# EAGLE design 00A-054 (EAGLE 9.6.2)
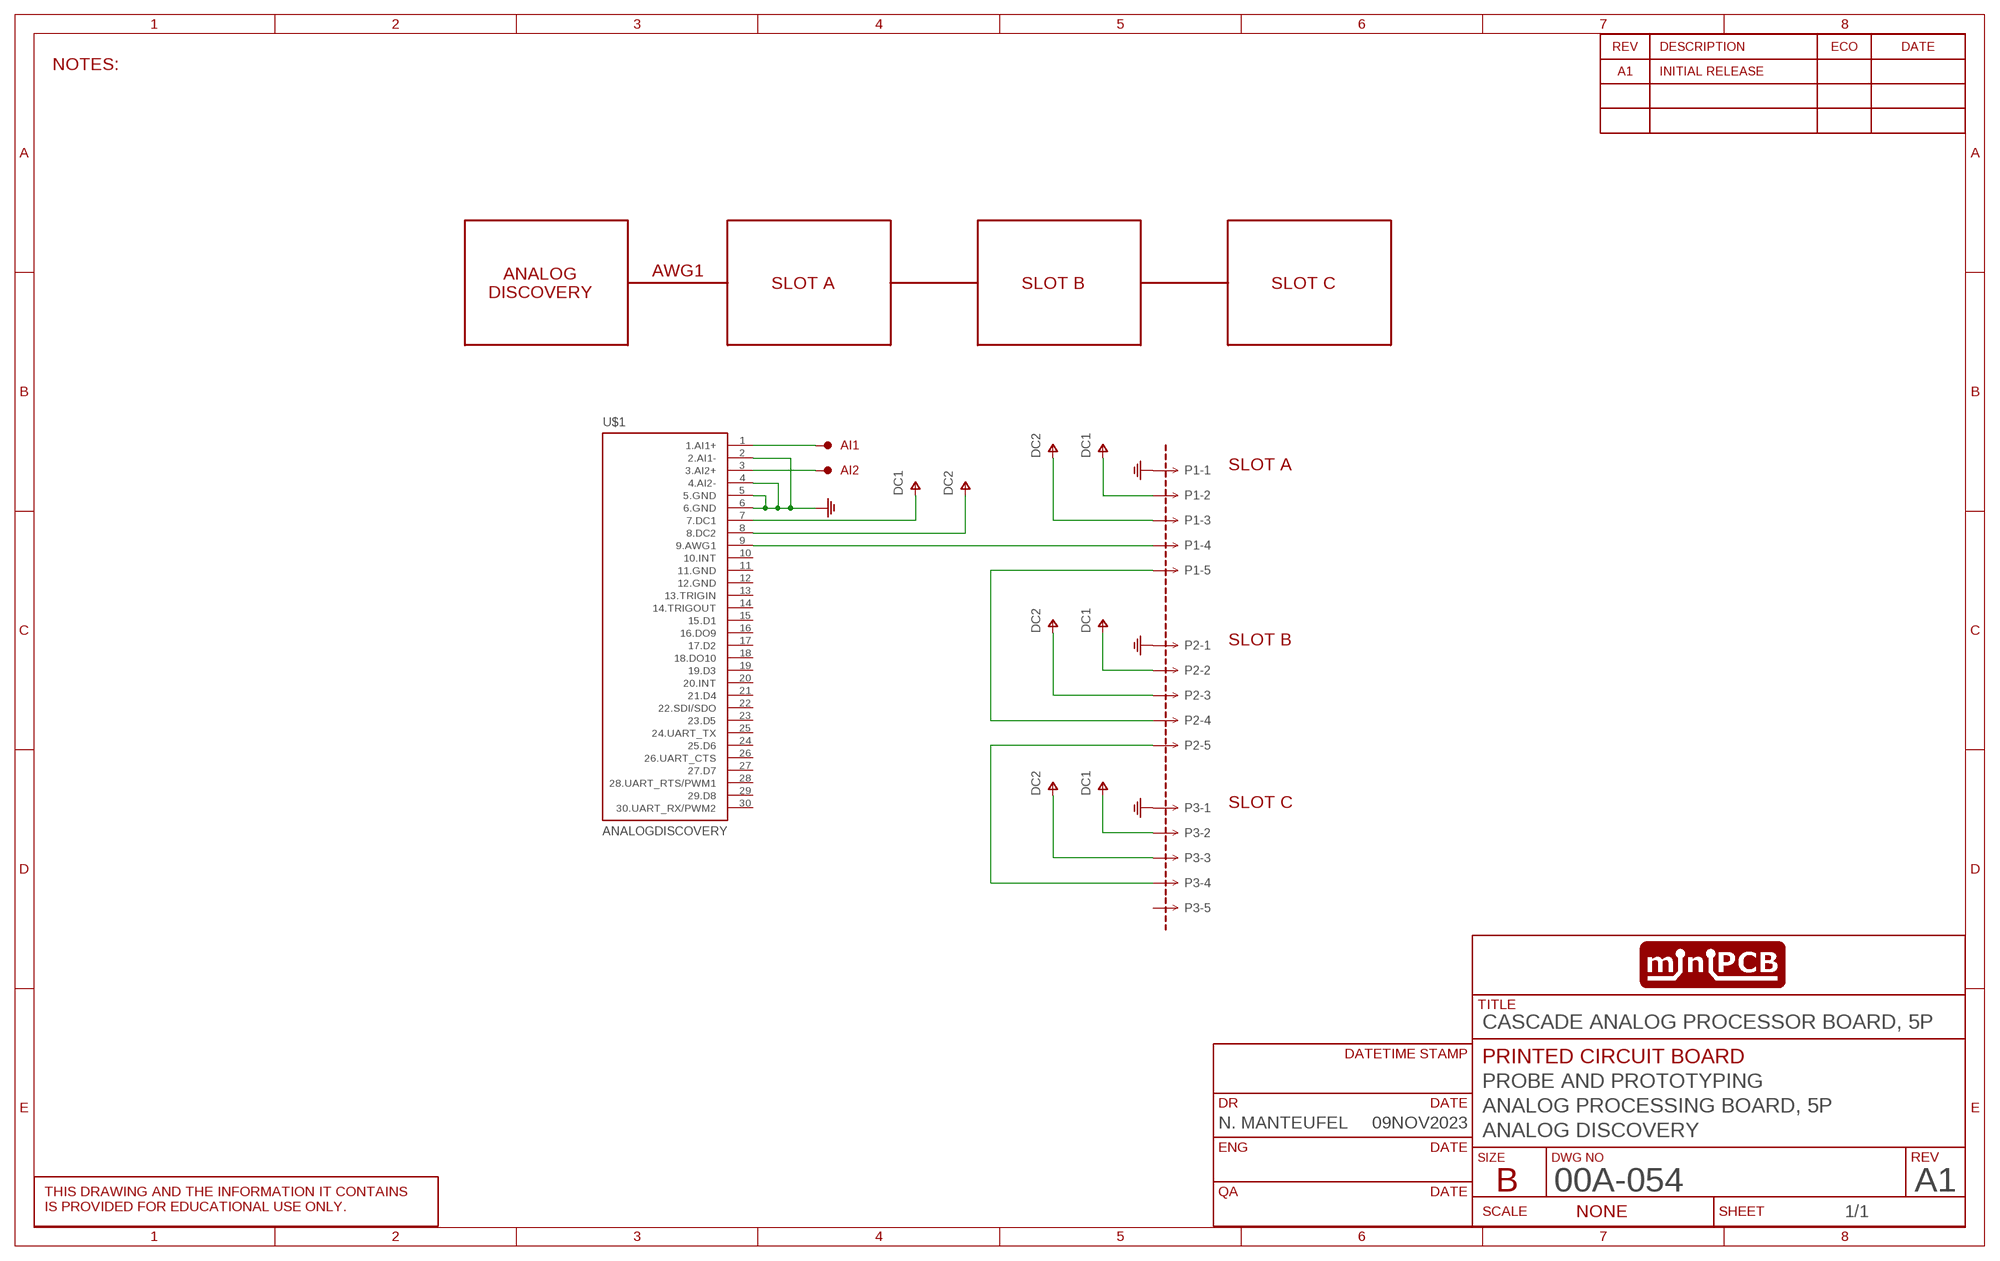
[diagram p0: schematic, sheet 1]
SHEET1 (SCHEMATIC): CIRCUIT_CATEGORY: PROBE AND PROTOTYPING; CIRCUIT_NAME: ANALOG PROCESSING BOARD, 5P; CIRCUIT_VARIANT: ANALOG DISCOVERY; DR: N. MANTEUFEL; DR_DATE: 09NOV2023; PCB_PCBA: PRINTED CIRCUIT BOARD; REVA: A1; REVISION: A1; TITLE: CASCADE ANALOG PROCESSOR BOARD, 5P

## Parts
AI1  TESTPOINTKE5000-SMTEXT  [PINS_1_TESTPOINT_KE5000_NOTEXT]
AI2  TESTPOINTKE5000-SMTEXT  [PINS_1_TESTPOINT_KE5000_NOTEXT]
P1  MINIPCB_5P5P  [PINS_1X5]
P2  MINIPCB_5P5P  [PINS_1X5]
P3  MINIPCB_5P5P  [PINS_1X5]
PCB1  MINIPCB_0P33X75  [MINIPCB_0P_33X75]
U$1  ANALOGDISCOVERY  [PINS30-2X15]

## Nets
GND: P1.1 P2.1 P3.1 U$1.2(2.AI1-) U$1.4(4.AI2-) U$1.5(5.GND) U$1.6(6.GND)
N$1: AI1.1 U$1.1(1.AI1+)
N$2: AI2.1 U$1.3(3.AI2+)
N$3: P1.4 U$1.9(9.AWG1)
N$4: P1.5 P2.4
N$5: P2.5 P3.4
V+: P1.2 P1.3 P2.2 P2.3 P3.2 P3.3 U$1.7(7.DC1) U$1.8(8.DC2) ; supply symbol labelled DC1, DC2
Unconnected: P3.5 U$1.10(10.INT) U$1.11(11.GND) U$1.12(12.GND) U$1.13(13.TRIGIN) U$1.14(14.TRIGOUT) U$1.15(15.D1) U$1.16(16.DO9) U$1.17(17.D2) U$1.18(18.DO10) U$1.19(19.D3) U$1.20(20.INT) U$1.21(21.D4) U$1.22(22.SDI/SDO) U$1.23(23.D5) U$1.24(25.D6) U$1.25(24.UART_TX) U$1.26(26.UART_CTS) U$1.27(27.D7) U$1.28(28.UART_RTS/PWM1) U$1.29(29.D8) U$1.30(30.UART_RX/PWM2)

## Notes on the sheet
- NOTES:
- AWG1
- ANALOG
  DISCOVERY
- SLOT A | SLOT B | SLOT C
- SLOT A
- SLOT B
- SLOT C

## Library data of the parts
AI1 AI2 = minipcb:TESTPOINT
P1-P3 = minipcb:MINIPCB_5P
PCB1 = minipcb:MINIPCB_0P; CIRCUIT_CATEGORY: PROBE AND PROTOTYPING; PART_NUMBER: 00A-054; REVISION: A1-01; TITLE: CASCADE ANALOG PROCESSOR BOARD, 5P
U$1 = minipcb:ANALOGDISCOVERY

## Board
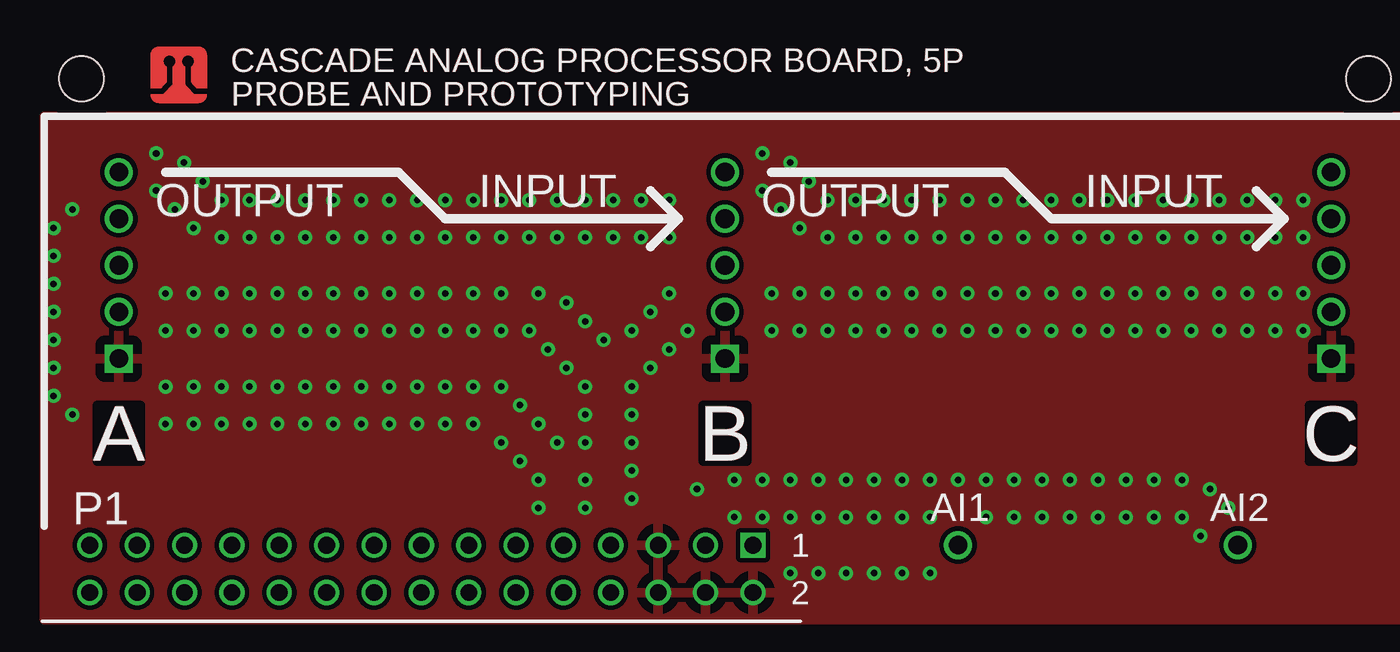
[diagram p1: board, top side]
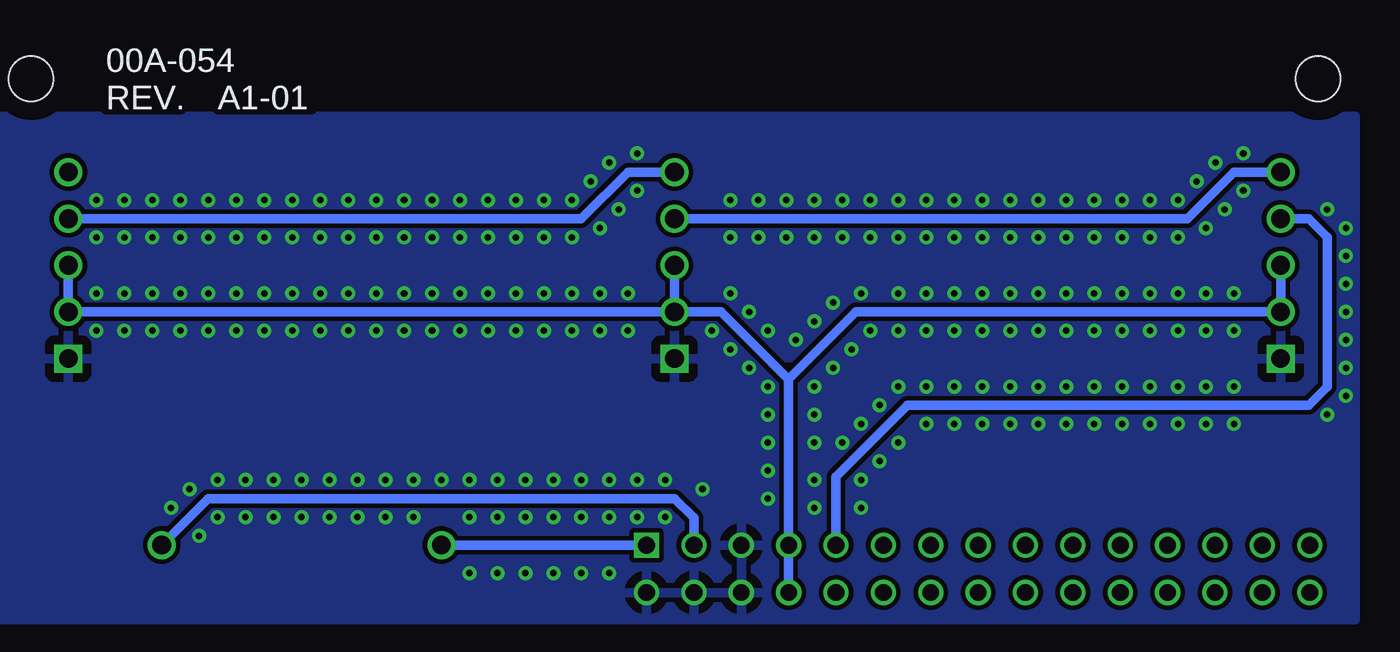
[diagram p2: board, bottom side, seen from below]

No outline drawn. Coordinates in mm, seen from the top.
Copper layers (1*16): Top 0.035mm / dielectric 1.5mm / Bottom 0.035mm
Design rules "minipcb": minimum track width 0.2mm, minimum drill 0.5mm, track to track 0.25mm, track to pad 0.5mm, pad to pad 0.5mm, via to via 0.5mm, smd to smd 0.15mm, copper to edge 1mm, drill to drill 1mm, minimum pad ring 0.2mm, minimum via ring 0.2mm, stop-mask expansion 0.1mm, vias tented up to drill 0.6mm, thermal gap 0.5mm

### Footprints (pad centres in the part's own frame; a part is rotated, then mirrored left to right if it is on the bottom)
PINS_1_TESTPOINT_KE5000_NOTEXT = drill 1: 1 0,0
PINS_1X5 = drill 1 square: 1 0,0 | drill 1: 2 2.5,0; 3 5,0; 4 7.5,0; 5 10,0
MINIPCB_0P_33X75 = hole 2.4: 72,30; 3,30
PINS30-2X15 = drill 0.9 square: 1 0,0 | drill 0.9: 2 0,2.54; 3 2.54,0; 4 2.54,2.54; 5 5.08,0; 6 5.08,2.54; 7 7.62,0; 8 7.62,2.54; 9 10.16,0; 10 10.16,2.54; 11 12.7,0; 12 12.7,2.54; 13 15.24,0; 14 15.24,2.54; 15 17.78,0; 16 17.78,2.54; 17 20.32,0; 18 20.32,2.54; 19 22.86,0; 20 22.86,2.54; 21 25.4,0; 22 25.4,2.54; 23 27.94,0; 24 27.94,2.54; 25 30.48,0; 26 30.48,2.54; 27 33.02,0; 28 33.02,2.54; 29 35.56,0; 30 35.56,2.54

### Placement (x,y rotation side)
AI1  50,5 0 top
AI2  65,5 0 top
P1  5,15 90 top
P2  37.5,15 90 top
P3  70,15 90 top
PCB1  0,0 0 top
U$1  39,5 180 top

### Tracks (layer width: path | path; a pad name or v marks a point on that pad's centre or on a via)
GND  (via drill 0.35)
  other vias: 7.5,13.5 9,13.5 10.5,13.5 12,13.5 7.5,11.5 9,11.5 10.5,11.5 12,11.5 13.5,11.5 15,11.5 16.5,11.5 18,11.5 19.5,11.5 21,11.5 22.5,11.5 24,11.5 13.5,13.5 15,13.5 16.5,13.5 18,13.5 19.5,13.5 21,13.5 22.5,13.5 24,13.5 25.5,13.5 26.5,12.5 27.5,11.5 28.5,10.5 25.5,10.5 26.5,9.5 27.5,8.5 30,13.5 29,14.5 28,15.5 27,16.5 31,16 30,17 29,18 27.5,18.5 9,18.5 10.5,18.5 12,18.5 13.5,18.5 9,16.5 10.5,16.5 12,16.5 13.5,16.5 15,16.5 16.5,16.5 18,16.5 19.5,16.5 21,16.5 22.5,16.5 24,16.5 25.5,16.5 15,18.5 16.5,18.5 18,18.5 19.5,18.5 21,18.5 22.5,18.5 24,18.5 25.5,18.5 10.5,23.5 12,23.5 13.5,23.5 15,23.5 10.5,21.5 12,21.5 13.5,21.5 15,21.5 16.5,21.5 18,21.5 19.5,21.5 21,21.5 22.5,21.5 24,21.5 25.5,21.5 27,21.5 16.5,23.5 18,23.5 19.5,23.5 21,23.5 22.5,23.5 24,23.5 25.5,23.5 27,23.5 28.5,21.5 30,21.5 31.5,21.5 33,21.5 34.5,21.5 28.5,23.5 30,23.5 31.5,23.5 33,23.5 34.5,23.5 40,18.5 41.5,18.5 43,18.5 44.5,18.5 40,16.5 41.5,16.5 43,16.5 44.5,16.5 46,16.5 47.5,16.5 49,16.5 50.5,16.5 52,16.5 53.5,16.5 55,16.5 56.5,16.5 46,18.5 47.5,18.5 49,18.5 50.5,18.5 52,18.5 53.5,18.5 55,18.5 56.5,18.5 58,16.5 59.5,16.5 61,16.5 62.5,16.5 64,16.5 58,18.5 59.5,18.5 61,18.5 62.5,18.5 64,18.5 43,23.5 44.5,23.5 46,23.5 47.5,23.5 43,21.5 44.5,21.5 46,21.5 47.5,21.5 49,21.5 50.5,21.5 52,21.5 53.5,21.5 55,21.5 56.5,21.5 58,21.5 59.5,21.5 49,23.5 50.5,23.5 52,23.5 53.5,23.5 55,23.5 56.5,23.5 58,23.5 59.5,23.5 61,21.5 62.5,21.5 64,21.5 65.5,21.5 67,21.5 61,23.5 62.5,23.5 64,23.5 65.5,23.5 67,23.5 65.5,16.5 67,16.5 65.5,18.5 67,18.5 9.5,24.5 8.5,25.5 7,26 9,22 8,23 7,24 7.5,18.5 7.5,16.5 30,12 30,10.5 32.5,13.5 32.5,12 32.5,10.5 30,8.5 30,7 27.5,7 32.5,9 32.5,7.5 33.5,14.5 32.5,16.5 33.5,17.5 34.5,18.5 34.5,15.5 35.5,16.5 42,24.5 41,25.5 39.5,26 41.5,22 40.5,23 39.5,24 68.5,23.5 68.5,21.5 68.5,18.5 68.5,16.5 38,8.5 39.5,8.5 41,8.5 42.5,8.5 38,6.5 39.5,6.5 41,6.5 42.5,6.5 44,6.5 45.5,6.5 47,6.5 48.5,6.5 51.5,6.5 53,6.5 54.5,6.5 44,8.5 45.5,8.5 47,8.5 48.5,8.5 50,8.5 51.5,8.5 53,8.5 54.5,8.5 56,6.5 57.5,6.5 59,6.5 60.5,6.5 62,6.5 56,8.5 57.5,8.5 59,8.5 60.5,8.5 62,8.5 41,3.5 42.5,3.5 44,3.5 45.5,3.5 47,3.5 48.5,3.5 63.5,8 64.5,7 63,5.5 36,8 1.5,13 1.5,14.5 1.5,16 2.5,12 2.5,23 1.5,17.5 1.5,19 1.5,20.5 1.5,22
  pour Top: 1,1 74,1 74,28 1,28
  pour Bottom: 1,1 74,1 74,28 1,28
N$1
  Bottom 0.5: U$1.1 AI1.1
N$2
  Bottom 0.5: U$1.3 36.46,6.46 37.5,7.5 62.5,7.5 AI2.1
N$3
  Bottom 0.5: U$1.9 28.84,8.66 25,12.5 3.5,12.5 2.5,13.5 2.5,21.5 3.5,22.5 P1.4
N$4
  Bottom 0.5: P1.5 7.5,25 10,22.5 P2.4
N$5
  Bottom 0.5: P2.5 40,25 42.5,22.5 P3.4
V+
  Bottom 0.5: U$1.8 U$1.7 31.38,13.88 | 31.38,13.88 35,17.5 P2.2 | P2.2 P2.3 | 31.38,13.88 27.76,17.5 P1.2 P1.3 | P3.3 P3.2 P2.2

### Text on the board
Top: A | B | C
tPlace: OUTPUT | INPUT | OUTPUT | INPUT | A | B | C